# EAGLE design Mega_Shield-v13 (EAGLE 6.5.0)
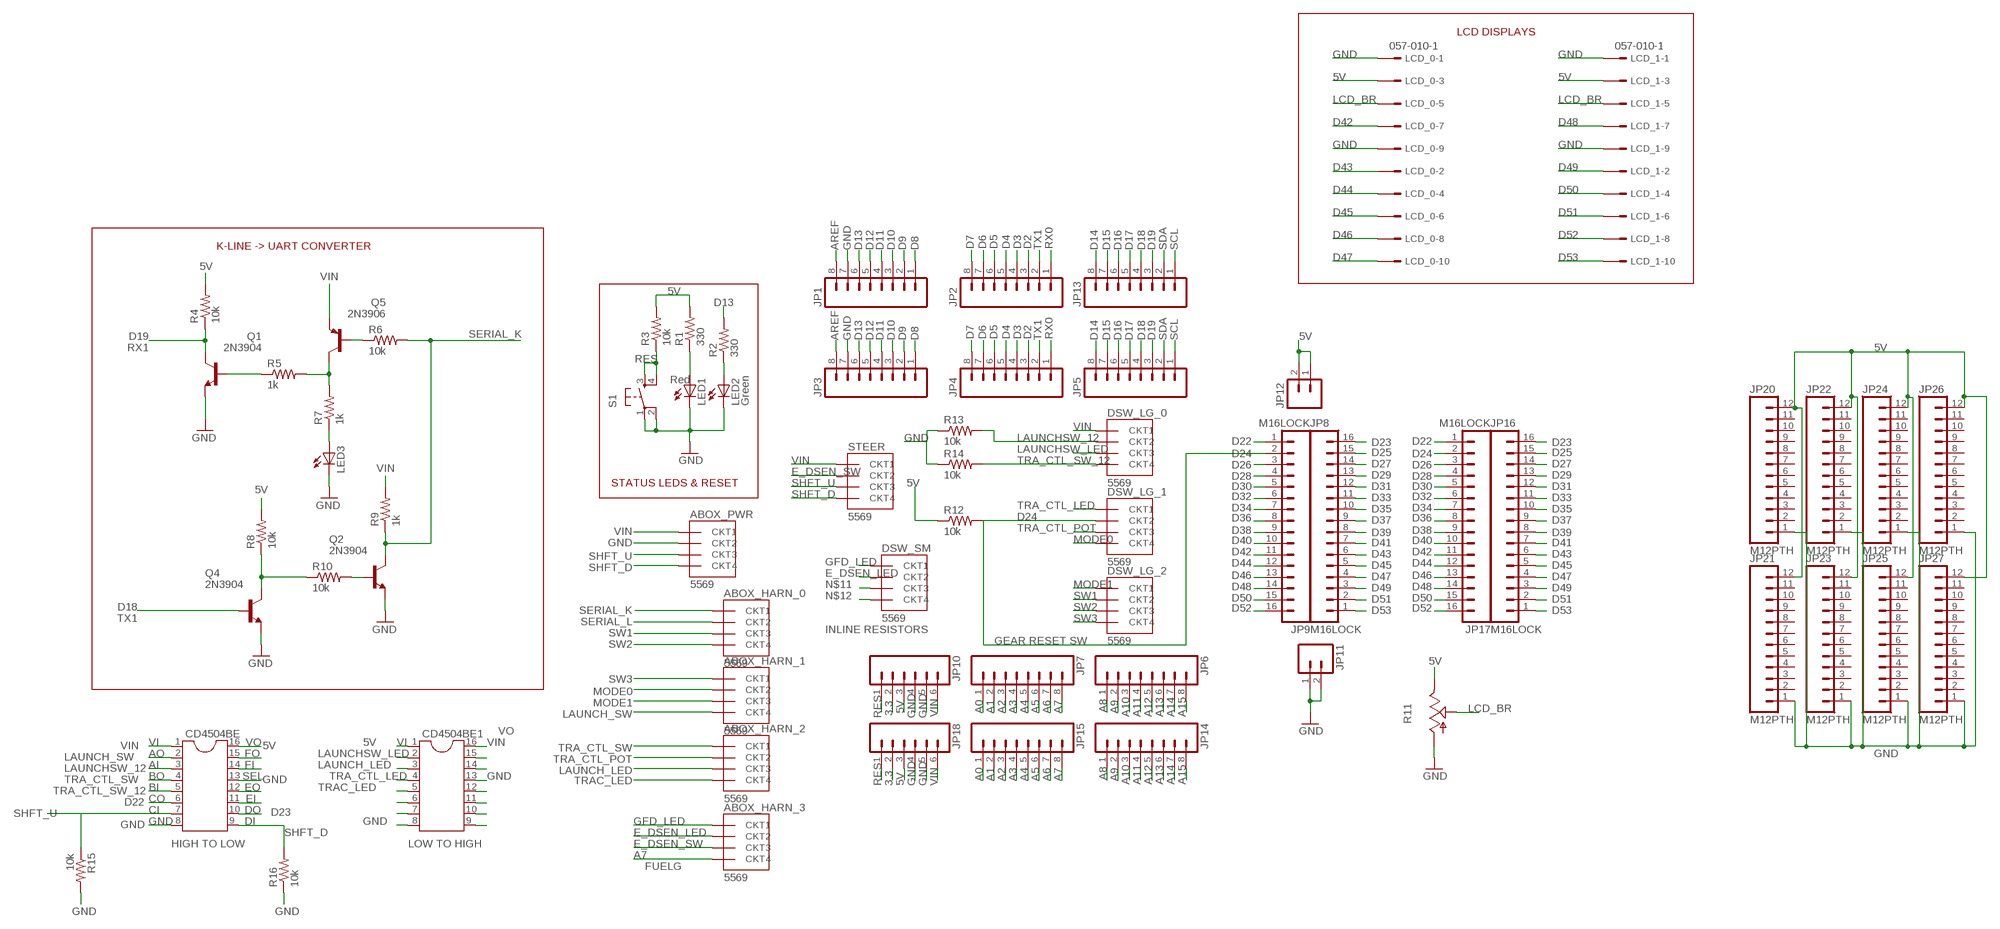
[diagram p0: schematic, sheet 1]

## Parts
ABOX_HARN_0  5569  [5569]
ABOX_HARN_1  5569  [5569]
ABOX_HARN_2  5569  [5569]
ABOX_HARN_3  5569  [5569]
ABOX_PWR  5569  [5569]
CD4504BE  DIL16S  [SOCKET-16]
CD4504BE1  DIL16S  [SOCKET-16]
DSW_LG_0  5569  [5569]
DSW_LG_1  5569  [5569]
DSW_LG_2  5569  [5569]
DSW_SM  5569  [5569]
JP1  M08LOCK  [1X08_LOCK]
JP2  M08LOCK  [1X08_LOCK]
JP3  M08LOCK  [1X08_LOCK]
JP4  M08LOCK  [1X08_LOCK]
JP5  M08LOCK  [1X08_LOCK]
JP6  M08LOCK  [1X08_LOCK]
JP7  M08LOCK  [1X08_LOCK]
JP8  M16LOCK  [1X16_LOCK]
JP9  M16LOCK  [1X16_LOCK]
JP10  M06LOCK  [1X06_LOCK]
JP11  M02LOCK  [1X02_LOCK]
JP12  M02LOCK  [1X02_LOCK]
JP13  M08LOCK  [1X08_LOCK]
JP14  M08LOCK  [1X08_LOCK]
JP15  M08LOCK  [1X08_LOCK]
JP16  M16LOCK  [1X16_LOCK]
JP17  M16LOCK  [1X16_LOCK]
JP18  M06LOCK  [1X06_LOCK]
JP20  M12PTH  [1X12]
JP21  M12PTH  [1X12]
JP22  M12PTH  [1X12]
JP23  M12PTH  [1X12]
JP24  M12PTH  [1X12]
JP25  M12PTH  [1X12]
JP26  M12PTH  [1X12]
JP27  M12PTH  [1X12]
LCD_0  057-010-1  [057-010-1]
LCD_1  057-010-1  [057-010-1]
LED1  Red  LED5MM  [LED5MM]
LED2  Green  LED5MM  [LED5MM]
LED3  LED5MM  [LED5MM]
Q1  2N3904  [TO92]
Q2  2N3904  [TO92]
Q4  2N3904  [TO92]
Q5  2N3906  [TO92]
R1  330  RESISTORPTH1  [AXIAL-0.3]
R2  330  RESISTORPTH1  [AXIAL-0.3]
R3  10k  RESISTORPTH1  [AXIAL-0.3]
R4  10k  RESISTOREZ  [AXIAL-0.3EZ]
R5  1k  RESISTOREZ  [AXIAL-0.3EZ]
R6  10k  RESISTOREZ  [AXIAL-0.3EZ]
R7  1k  RESISTOREZ  [AXIAL-0.3EZ]
R8  10k  RESISTOREZ  [AXIAL-0.3EZ]
R9  1k  RESISTOREZ  [AXIAL-0.3EZ]
R10  10k  RESISTOREZ  [AXIAL-0.3EZ]
R11  TRIM_US-CT6  [CT6]
R12  10k  RESISTOREZ  [AXIAL-0.3EZ]
R13  10k  RESISTOREZ  [AXIAL-0.3EZ]
R14  10k  RESISTOREZ  [AXIAL-0.3EZ]
R15  10k  RESISTOREZ  [AXIAL-0.3EZ]
R16  10k  RESISTOREZ  [AXIAL-0.3EZ]
S1  TAC_SWITCHPTH  [TACTILE-PTH]
STEER  5569  [5569]

## Nets
3.3: JP10.2 JP18.2
5V: CD4504BE1.1 CD4504BE.16 JP10.3 JP12.1 JP12.2 JP18.3 JP20.12 JP21.12 JP22.12 JP23.12 JP24.12 JP25.12 JP26.12 JP27.12 LCD_0.3 LCD_1.3 R1.P$2 R3.P$2 R4.P$2 R8.P$2 R11.E R12.P$1
A0: JP7.1 JP15.1
A1: JP7.2 JP15.2
A2: JP7.3 JP15.3
A3: JP7.4 JP15.4
A4: JP7.5 JP15.5
A5: JP7.6 JP15.6
A6: JP7.7 JP15.7
A7: ABOX_HARN_3.CKT4 JP7.8 JP15.8
A8: JP6.1 JP14.1
A9: JP6.2 JP14.2
A10: JP6.3 JP14.3
A11: JP6.4 JP14.4
A12: JP6.5 JP14.5
A13: JP6.6 JP14.6
A14: JP6.7 JP14.7
A15: JP6.8 JP14.8
AREF: JP1.8 JP3.8
D2: JP2.3 JP4.3
D3: JP2.4 JP4.4
D4: JP2.5 JP4.5
D5: JP2.6 JP4.6
D6: JP2.7 JP4.7
D7: JP2.8 JP4.8
D8: JP1.1 JP3.1
D9: JP1.2 JP3.2
D10: JP1.3 JP3.3
D11: JP1.4 JP3.4
D12: JP1.5 JP3.5
D13: JP1.6 JP3.6 R2.P$2
D14: JP5.8 JP13.8
D15: JP5.7 JP13.7
D16: JP5.6 JP13.6
D17: JP5.5 JP13.5
D18: JP5.4 JP13.4 Q4.2(B)
D19: JP5.3 JP13.3 Q1.1(C) R4.P$1
D22: CD4504BE.6 JP9.1 JP17.1
D23: CD4504BE.10 JP8.16 JP16.16
D24: DSW_LG_1.CKT2 JP9.2 JP17.2 R12.P$2
D25: JP8.15 JP16.15
D26: JP9.3 JP17.3
D27: JP8.14 JP16.14
D28: JP9.4 JP17.4
D29: JP8.13 JP16.13
D30: JP9.5 JP17.5
D31: JP8.12 JP16.12
D32: JP9.6 JP17.6
D33: JP8.11 JP16.11
D34: JP9.7 JP17.7
D35: JP8.10 JP16.10
D36: JP9.8 JP17.8
D37: JP8.9 JP16.9
D38: JP9.9 JP17.9
D39: JP8.8 JP16.8
D40: JP9.10 JP17.10
D41: JP8.7 JP16.7
D42: JP9.11 JP17.11 LCD_0.7
D43: JP8.6 JP16.6 LCD_0.2
D44: JP9.12 JP17.12 LCD_0.4
D45: JP8.5 JP16.5 LCD_0.6
D46: JP9.13 JP17.13 LCD_0.8
D47: JP8.4 JP16.4 LCD_0.10
D48: JP9.14 JP17.14 LCD_1.7
D49: JP8.3 JP16.3 LCD_1.2
D50: JP9.15 JP17.15 LCD_1.4
D51: JP8.2 JP16.2 LCD_1.6
D52: JP9.16 JP17.16 LCD_1.8
D53: JP8.1 JP16.1 LCD_1.10
E_DSEN_LED: ABOX_HARN_3.CKT2 DSW_SM.CKT2
E_DSEN_SW: ABOX_HARN_3.CKT3 STEER.CKT2
GFD_LED: ABOX_HARN_3.CKT1 DSW_SM.CKT1
GND: ABOX_PWR.CKT2 CD4504BE1.8 CD4504BE1.13 CD4504BE.8 CD4504BE.13 JP1.7 JP3.7 JP10.4 JP10.5 JP11.1 JP11.2 JP18.4 JP18.5 JP20.1 JP21.1 JP22.1 JP23.1 JP24.1 JP25.1 JP26.1 JP27.1 LCD_0.1 LCD_0.9 LCD_1.1 LCD_1.9 LED1.K(C) LED2.K(C) LED3.K(C) Q1.3(E) Q2.3(E) Q4.3(E) R11.A R13.P$1 R14.P$1 R15.P$2 R16.P$1 S1.1 S1.2
LAUNCH_LED: ABOX_HARN_2.CKT3 CD4504BE1.3
LAUNCH_SW: ABOX_HARN_1.CKT4 CD4504BE.2
LAUNCHSW_12: CD4504BE.3 DSW_LG_0.CKT2 R13.P$2
LAUNCHSW_LED: CD4504BE1.2 DSW_LG_0.CKT3
LCD_BR: LCD_0.5 LCD_1.5 R11.S
MODE0: ABOX_HARN_1.CKT2 DSW_LG_1.CKT4
MODE1: ABOX_HARN_1.CKT3 DSW_LG_2.CKT1
N$2: CD4504BE.11
N$4: Q1.2(B) R5.P$1
N$5: Q5.1(C) R5.P$2 R7.P$2
N$6: Q5.2(B) R6.P$1
N$7: LED3.A R7.P$1
N$8: Q2.2(B) R10.P$2
N$10: Q4.1(C) R8.P$1 R10.P$1
N$11: DSW_SM.CKT3
N$12: DSW_SM.CKT4
N$19: CD4504BE.15
N$20: CD4504BE.14
N$22: CD4504BE.12
N$27: CD4504BE1.6
N$28: CD4504BE1.7
N$32: CD4504BE1.15
N$33: CD4504BE1.14
N$35: CD4504BE1.12
N$36: CD4504BE1.11
N$37: CD4504BE1.10
N$38: CD4504BE1.9
N$126: LED1.A R1.P$1
N$127: LED2.A R2.P$1
RES: JP10.1 JP18.1 R3.P$1 S1.3 S1.4
RX0: JP2.1 JP4.1
SCL: JP5.1 JP13.1
SDA: JP5.2 JP13.2
SERIAL_K: ABOX_HARN_0.CKT1 Q2.1(C) R6.P$2 R9.P$1
SERIAL_L: ABOX_HARN_0.CKT2
SHFT_D: ABOX_PWR.CKT4 CD4504BE.9 R16.P$2 STEER.CKT4
SHFT_U: ABOX_PWR.CKT3 CD4504BE.7 R15.P$1 STEER.CKT3
SW1: ABOX_HARN_0.CKT3 DSW_LG_2.CKT2
SW2: ABOX_HARN_0.CKT4 DSW_LG_2.CKT3
SW3: ABOX_HARN_1.CKT1 DSW_LG_2.CKT4
TRA_CTL_LED: CD4504BE1.4 DSW_LG_1.CKT1
TRA_CTL_POT: ABOX_HARN_2.CKT2 DSW_LG_1.CKT3
TRA_CTL_SW: ABOX_HARN_2.CKT1 CD4504BE.4
TRA_CTL_SW_12: CD4504BE.5 DSW_LG_0.CKT4 R14.P$2
TRAC_LED: ABOX_HARN_2.CKT4 CD4504BE1.5
TX1: JP2.2 JP4.2
VIN: ABOX_PWR.CKT1 CD4504BE1.16 CD4504BE.1 DSW_LG_0.CKT1 JP10.6 JP18.6 Q5.3(E) R9.P$2 STEER.CKT1
Unconnected: JP20.2 JP20.3 JP20.4 JP20.5 JP20.6 JP20.7 JP20.8 JP20.9 JP20.10 JP20.11 JP21.2 JP21.3 JP21.4 JP21.5 JP21.6 JP21.7 JP21.8 JP21.9 JP21.10 JP21.11 JP22.2 JP22.3 JP22.4 JP22.5 JP22.6 JP22.7 JP22.8 JP22.9 JP22.10 JP22.11 JP23.2 JP23.3 JP23.4 JP23.5 JP23.6 JP23.7 JP23.8 JP23.9 JP23.10 JP23.11 JP24.2 JP24.3 JP24.4 JP24.5 JP24.6 JP24.7 JP24.8 JP24.9 JP24.10 JP24.11 JP25.2 JP25.3 JP25.4 JP25.5 JP25.6 JP25.7 JP25.8 JP25.9 JP25.10 JP25.11 JP26.2 JP26.3 JP26.4 JP26.5 JP26.6 JP26.7 JP26.8 JP26.9 JP26.10 JP26.11 JP27.2 JP27.3 JP27.4 JP27.5 JP27.6 JP27.7 JP27.8 JP27.9 JP27.10 JP27.11

## Notes on the sheet
- LCD DISPLAYS
- K-LINE -> UART CONVERTER
- RX1
- STATUS LEDS & RESET
- TX1
- INLINE RESISTORS
- GEAR RESET SW
- VO
- VI | VO | VI
- AO | FO
- AI | FI
- BO | SEL
- BI | EO
- CO | EI
- CI | DO
- GND | DI
- HIGH TO LOW | LOW TO HIGH
- FUELG

## Library data of the parts
ABOX_HARN_0 ABOX_HARN_1-ABOX_HARN_3 ABOX_PWR DSW_LG_0 DSW_LG_1 DSW_LG_2 DSW_SM STEER = MHR14:5569
CD4504BE CD4504BE1 = ic-package:DIL16: Dual In Line / Socket
JP1-JP7 JP13-JP15 = SparkFun:M08: Header 8 Standard 8-pin 0.1" header. Use with straight break away headers (SKU : PRT-00116), right angle break away headers (PRT-00553), swiss pins (PRT-00743), machine pins (PRT-00117), and female headers (PRT-00115).
JP8 JP9 JP16 JP17 = SparkFun:M16
JP10 JP18 = SparkFun:M06: Header 6 Standard 6-pin 0.1" header. Use with straight break away headers (SKU : PRT-00116), right angle break away headers (PRT-00553), swiss pins (PRT-00743), machine pins (PRT-00117), and female headers (PRT-00115). Molex polarized connector foot print use with SKU : PRT-08094 with associated crimp pins and housings. NOTES ON THE VARIANTS LOCK and LOCK_LONGPADS... This footprint was designed to help hold the alignment of a through-hole component (i.e. 6-pin header) while soldering it into place. You may notice that each hole has been shifted either up or down by 0.005 of an inch from it's more standard position (which is a perfectly straight line). This slight alteration caused the pins (the squares in the middle) to touch the edges of the holes. Because they are alternating, it causes a "brace" to hold the component in place. 0.005 has proven to be the perfect amount of "off-center" position when using our standard breakaway headers. Although looks a little odd when you look at the bare footprint, once you have a header in there, the alteration is very hard to notice. Also, if you push a header all the way into place, it is covered up entirely on the bottom side. This idea of altering the position of holes to aid alignment will be further integrated into the Sparkfun Library for other footprints. It can help hold any component with 3 or more connection pins.
JP11 JP12 = SparkFun:M02: Header 2 Standard 2-pin 0.1" header. Use with straight break away headers (SKU : PRT-00116), right angle break away headers (PRT-00553), swiss pins (PRT-00743), machine pins (PRT-00117), and female headers (PRT-00115). Molex polarized connector foot print use with SKU : PRT-08233 with associated crimp pins and housings.
JP20-JP27 = SparkFun-Connectors:M12: Header 12 Standard 12-pin 0.1" header. Use with straight break away headers (SKU : PRT-00116), right angle break away headers (PRT-00553), swiss pins (PRT-00743), machine pins (PRT-00117), and female headers (PRT-00115).
LCD_0 LCD_1 = con-panduit:057-010-: CONNECTOR 10-pin series 057 contact pc board low profile headers; OC_FARNELL: unknown; OC_NEWARK: unknown
LED1 LED2 = SparkFun:LED: LEDs Standard schematic elements and footprints for 5mm, 3mm, 1206, and 0603 sized LEDs. 5mm - Spark Fun Electronics SKU : COM-00529 (and others)
LED3 = led:LED: LED OSRAM: - CHIPLED LG R971, LG N971, LY N971, LG Q971, LY Q971, LO R971, LY R971 LH N974, LH R974 LS Q976, LO Q976, LY Q976 LO Q996 - Hyper CHIPLED LW Q18S LB Q993, LB Q99A, LB R99A - SideLED LS A670, LO A670, LY A670, LG A670, LP A670 LB A673, LV A673, LT A673, LW A673 LH A674 LY A675 LS A676, LA A676, LO A676, LY A676, LW A676 LS A679, LY A679, LG A679 - Hyper Micro SIDELED® LS Y876, LA Y876, LO Y876, LY Y876 LT Y87S - SmartLED LW L88C, LW L88S LB L89C, LB L89S, LG L890 LS L89K, LO L89K, LY L89K LS L896, LA L896, LO L896, LY L896 - TOPLED LS T670, LO T670, LY T670, LG T670, LP T670 LSG T670, LSP T670, LSY T670, LOP T670, LYG T670 LG T671, LOG T671, LSG T671 LB T673, LV T673, LT T673, LW T673 LH T674 LS T676, LA T676, LO T676, LY T676, LB T676, LH T676, LSB T676, LW T676 LB T67C, LV T67C, LT T67C, LS T67K, LO T67K, LY T67K, LW E67C LS E67B, LA E67B, LO E67B, LY E67B, LB E67C, LV E67C, LT E67C LW T67C LS T679, LY T679, LG T679 LS T770, LO T770, LY T770, LG T770, LP T770 LB T773, LV T773, LT T773, LW T773 LH T774 LS E675, LA E675, LY E675, LS T675 LS T776, LA T776, LO T776, LY T776, LB T776 LHGB T686 LT T68C, LB T68C - Hyper Mini TOPLED® LB M676 - Mini TOPLED Santana® LG M470 LS M47K, LO M47K, LY M47K Source: http://www.osram.convergy.de LUXEON: - LUMILED® LXK2-PW12-R00, LXK2-PW12-S00, LXK2-PW14-U00, LXK2-PW14-V00 LXK2-PM12-R00, LXK2-PM12-S00, LXK2-PM14-U00 LXK2-PE12-Q00, LXK2-PE12-R00, LXK2-PE12-S00, LXK2-PE14-T00, LXK2-PE14-U00 LXK2-PB12-K00, LXK2-PB12-L00, LXK2-PB12-M00, LXK2-PB14-N00, LXK2-PB14-P00, LXK2-PB14-Q00 LXK2-PR12-L00, LXK2-PR12-M00, LXK2-PR14-Q00, LXK2-PR14-R00 LXK2-PD12-Q00, LXK2-PD12-R00, LXK2-PD12-S00 LXK2-PH12-R00, LXK2-PH12-S00 LXK2-PL12-P00, LXK2-PL12-Q00, LXK2-PL12-R00 Source: www.luxeon.com KINGBRIGHT: KA-3528ASYC Source: www.kingbright.com
Q1 Q2 Q4 = transistor-npn:2N3904: NPN Transistor
Q5 = transistor-pnp:2N3906: PNP Transistor
R1-R3 = SparkFun:RESISTOR: Resistor
R4-R10 R12-R16 = SparkFun-Passives:RESISTOR: Resistor
R11 = pot:TRIM_US-: POTENTIOMETER
S1 = SparkFun:TAC_SWITCH: Momentary Switch Button commonly used for reset or general input. Spark Fun Electronics SKU : COM-00097

## Board
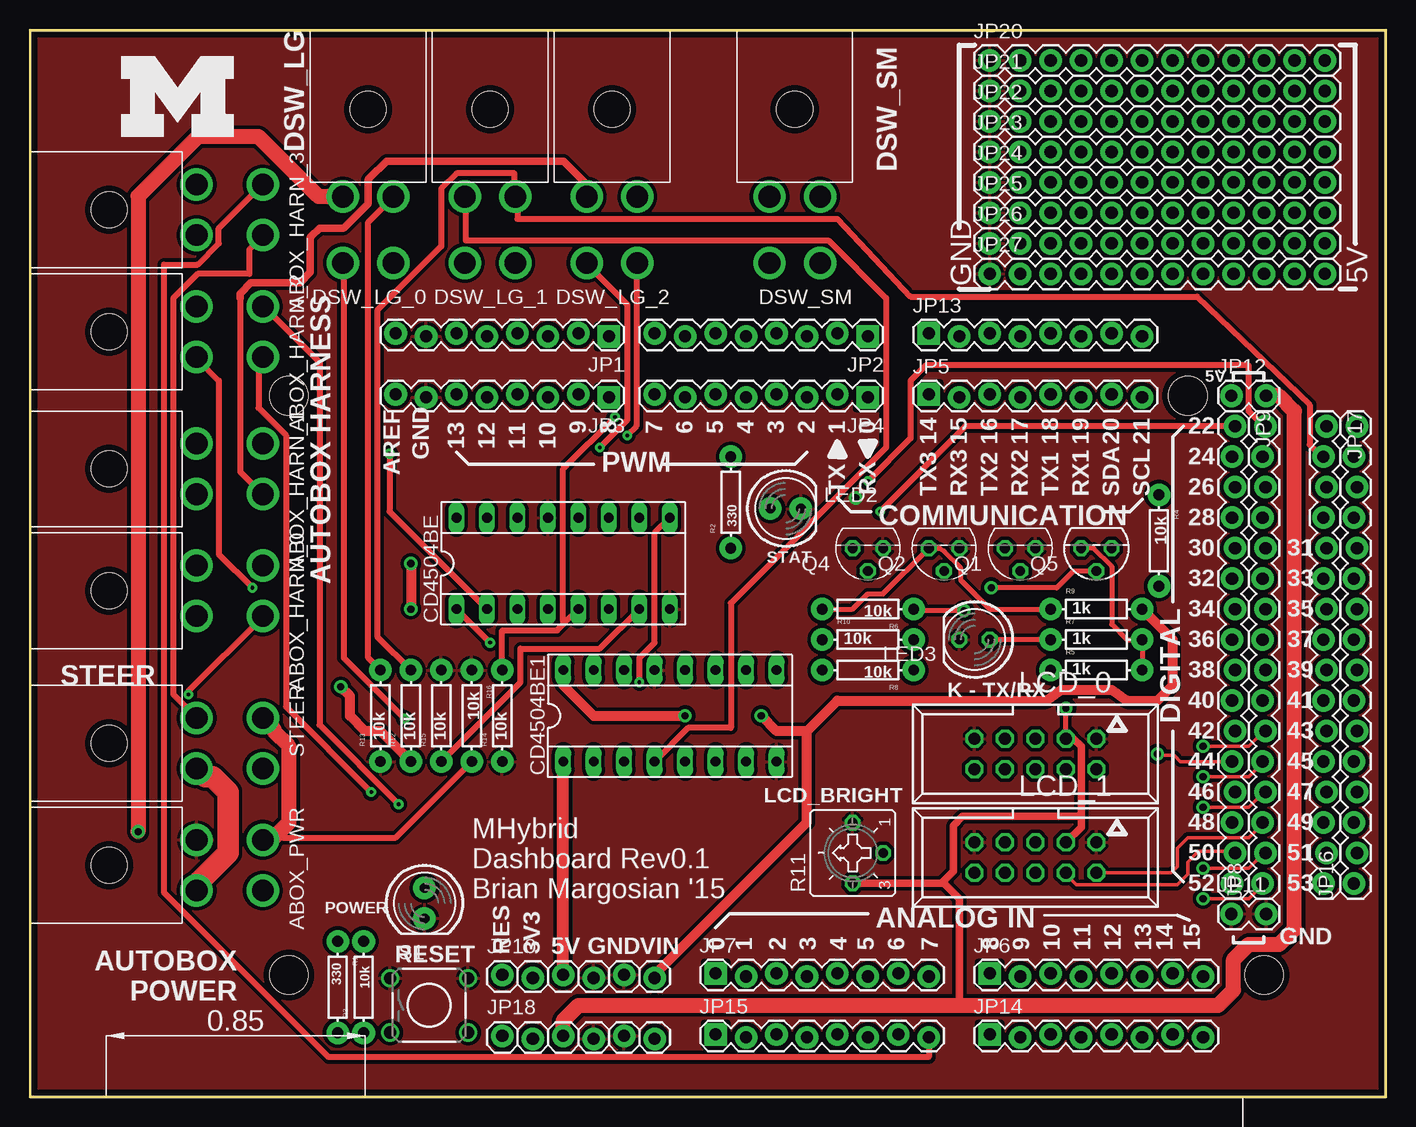
[diagram p1: board, top side]
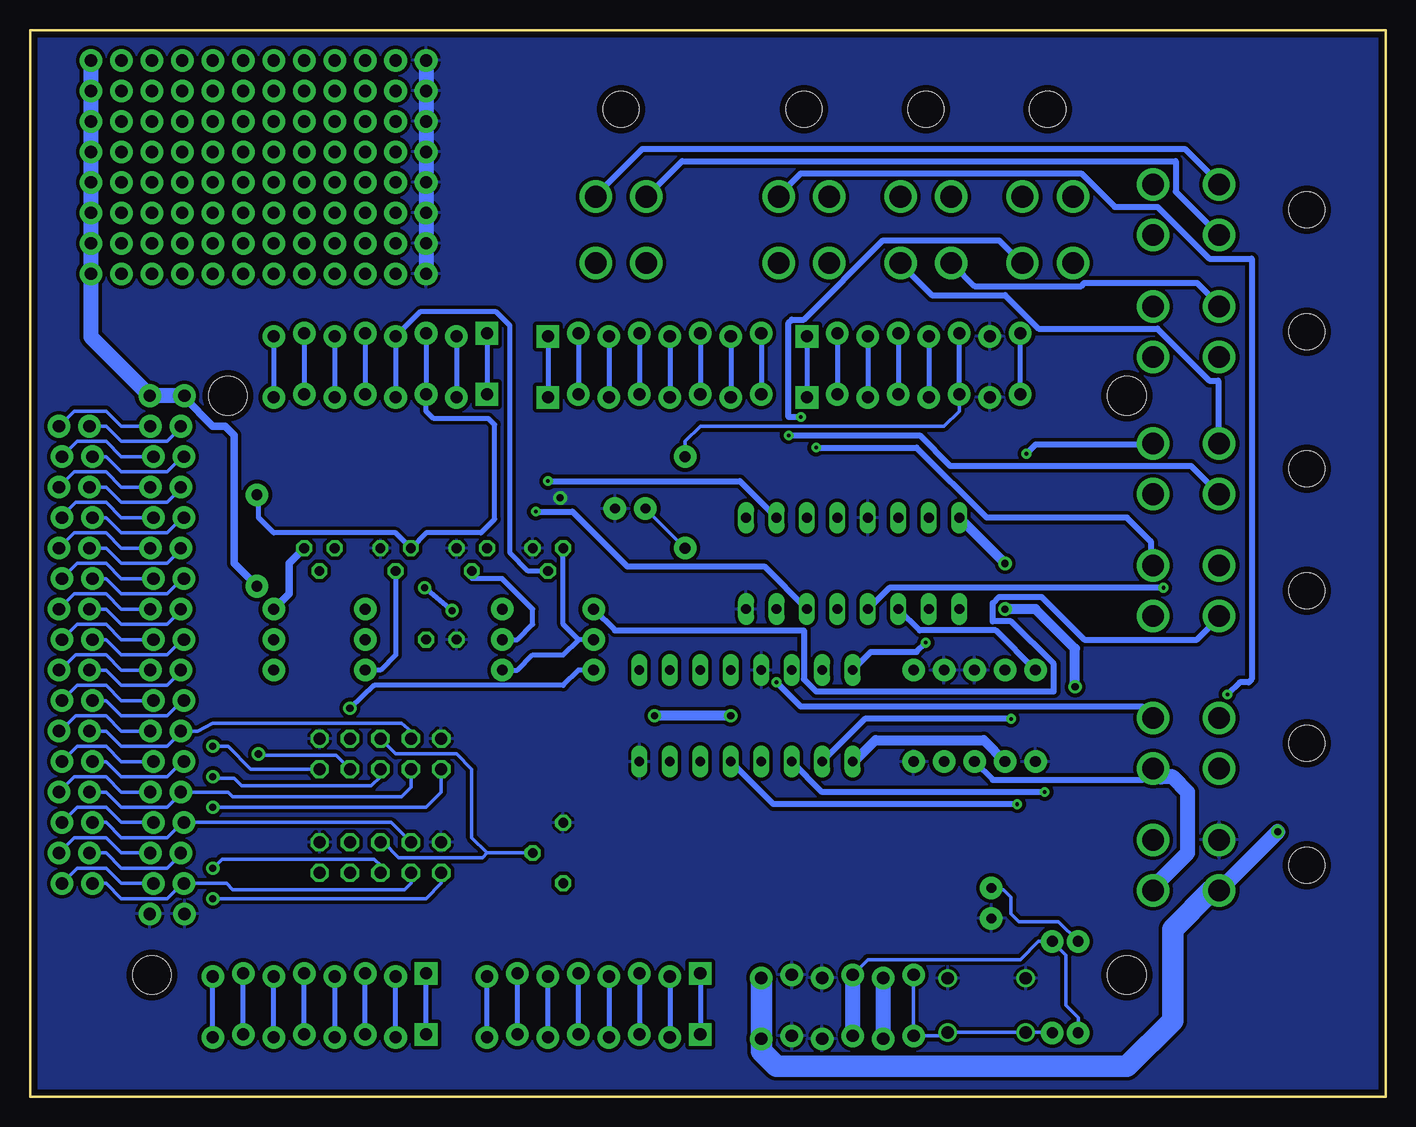
[diagram p2: board, bottom side, seen from below]

Size 113.03 x 88.9 mm. Coordinates in mm from the lower left corner, seen from the top.
Outline: 0,0 113.03,0 113.03,88.9 0,88.9 0,0
Copper layers (1+16): Top 0.0178mm / dielectric 12mil / Bottom 0.0178mm
Design rules "AVC-2Lyr *": minimum track width 20mil, minimum drill 12mil, track to track 10mil, track to pad 6mil, pad to pad 6mil, via to via 6mil, smd to smd 6mil, copper to edge 20mil, drill to drill 16mil, minimum pad ring 10mil, minimum via ring 10mil, stop-mask expansion 3mil, vias tented up to drill 0mil, thermal gap 10mil
Holes 3.2 mm at 21.59,58.42 21.59,10.16 96.52,58.42 102.87,10.16

### Footprints (pad centres in the part's own frame; a part is rotated, then mirrored left to right if it is on the bottom)
5569 = drill 1.803: CKT1 6.934,13.894; CKT2 2.718,13.894; CKT3 6.934,19.406; CKT4 2.718,19.406 | hole 2.997: 4.826,6.604
SOCKET-16 = drill 0.813 long: 1 -8.89,-3.81; 2 -6.35,-3.81; 3 -3.81,-3.81; 4 -1.27,-3.81; 5 1.27,-3.81; 6 3.81,-3.81; 7 6.35,-3.81; 8 8.89,-3.81; 9 8.89,3.81; 10 6.35,3.81; 11 3.81,3.81; 12 1.27,3.81; 13 -1.27,3.81; 14 -3.81,3.81; 15 -6.35,3.81; 16 -8.89,3.81
1X08_LOCK = drill 1.016 pad 1.88 square: 1 0,0.127 | drill 1.016 pad 1.88: 2 2.54,-0.127; 3 5.08,0.127; 4 7.62,-0.127; 5 10.16,0.127; 6 12.7,-0.127; 7 15.24,0.127; 8 17.78,-0.127
1X16_LOCK = drill 1.016 pad 1.88: 1 0,0.127; 2 2.54,-0.127; 3 5.08,0.127; 4 7.62,-0.127; 5 10.16,0.127; 6 12.7,-0.127; 7 15.24,0.127; 8 17.78,-0.127; 9 20.32,0.127; 10 22.86,-0.127; 11 25.4,0.127; 12 27.94,-0.127; 13 30.48,0.127; 14 33.02,-0.127; 15 35.56,0.127; 16 38.1,-0.127
1X06_LOCK = drill 1.016 pad 1.88: 1 0,0; 2 2.54,-0.254; 3 5.08,0; 4 7.62,-0.254; 5 10.16,0; 6 12.7,-0.254
1X02_LOCK = drill 1.016 pad 1.88: 1 -0.178,0; 2 2.718,0
1X12 = drill 1.016 pad 1.88: 1 0,0; 2 2.54,0; 3 5.08,0; 4 7.62,0; 5 10.16,0; 6 12.7,0; 7 15.24,0; 8 17.78,0; 9 20.32,0; 10 22.86,0; 11 25.4,0; 12 27.94,0
057-010-1 = drill 1 octagon: 1 -5.08,-1.27; 2 -5.08,1.27; 3 -2.54,-1.27; 4 -2.54,1.27; 5 0,-1.27; 6 0,1.27; 7 2.54,-1.27; 8 2.54,1.27; 9 5.08,-1.27; 10 5.08,1.27
LED5MM = drill 0.813 pad 1.88: A -1.27,0; K 1.27,0
LED5MM' = drill 0.813 octagon: A -1.27,0; K 1.27,0
TO92 = drill 0.813 octagon: 1 1.27,0; 2 0,1.905; 3 -1.27,0
AXIAL-0.3 = drill 0.9 pad 1.88: P$1 -3.81,0; P$2 3.81,0
AXIAL-0.3EZ = drill 0.9 pad 1.88: P$1 -3.81,0; P$2 3.81,0
CT6 = drill 0.813 octagon: A 2.515,0; E -2.515,0; S 0,-2.54
TACTILE-PTH = drill 1.016: 1 -3.251,2.261; 2 3.251,2.261; 3 -3.251,-2.261; 4 3.251,-2.261

### Placement (x,y rotation side)
ABOX_HARN_0  0,46.99 270 top
ABOX_HARN_1  0,57.15 270 top
ABOX_HARN_2  0,68.58 270 top
ABOX_HARN_3  0,78.74 270 top
ABOX_PWR  0,24.13 270 top
CD4504BE  44.45,44.45 0 top
CD4504BE1  53.34,31.75 0 top
DSW_LG_0  33.02,88.9 180 top
DSW_LG_1  43.18,88.9 180 top
DSW_LG_2  53.34,88.9 180 top
DSW_SM  68.58,88.9 180 top
JP1  48.26,63.5 180 top
JP2  69.85,63.5 180 top
JP3  48.26,58.42 180 top
JP4  69.85,58.42 180 top
JP5  74.93,58.42 0 top
JP6  80.01,10.16 0 top
JP7  57.15,10.16 0 top
JP8  102.87,17.78 90 top
JP9  100.33,55.88 270 top
JP10  39.37,10.16 0 top
JP11  100.33,15.24 0 top
JP12  100.33,58.42 0 top
JP13  74.93,63.5 0 top
JP14  80.01,5.08 0 top
JP15  57.15,5.08 0 top
JP16  110.49,17.78 90 top
JP17  107.95,55.88 270 top
JP18  39.37,5.08 0 top
JP20  80.01,86.36 0 top
JP21  80.01,83.82 0 top
JP22  80.01,81.28 0 top
JP23  80.01,78.74 0 top
JP24  80.01,76.2 0 top
JP25  80.01,73.66 0 top
JP26  80.01,71.12 0 top
JP27  80.01,68.58 0 top
LCD_0  83.82,28.57 180 top
LCD_1  83.82,19.94 180 top
LED1  32.89,16.13 270 top
LED2  62.99,49.02 0 top
LED3  [LED5MM']  78.74,38.1 180 top
Q1  82.55,45.72 180 top
Q2  76.2,45.72 180 top
Q4  69.85,45.72 180 top
Q5  88.9,45.72 180 top
R1  25.65,9.14 270 top
R2  58.42,49.53 90 top
R3  27.81,9.14 90 top
R4  94.11,46.35 270 top
R5  88.9,35.56 0 top
R6  69.85,40.64 180 top
R7  88.9,38.1 0 top
R8  69.85,35.56 180 top
R9  88.9,40.64 0 top
R10  69.85,38.1 0 top
R11  68.58,20.32 90 top
R12  31.75,31.75 90 top
R13  29.21,31.75 90 top
R14  39.37,31.75 90 top
R15  34.29,31.75 90 top
R16  36.83,31.75 270 top
S1  33.27,7.62 0 top
STEER  0,34.29 270 top
U$1  [BLOCKM]  7.62,80.01 0 top

### Tracks (layer width: path | path; a pad name or v marks a point on that pad's centre or on a via)
3.3
  Top 0.203: JP10.2 41.91,10.16
  Bottom 1.27: JP10.2 JP18.2
5V  (via drill 0.6)
  Top 0.406: LCD_0.3 v86.36,32.38
  Top 0.61: LCD_0.3 87,29.84 87.63,29.21 87.63,23.62 | 87.63,23.62 87.63,22.48 LCD_1.3 | 87.63,23.62 87.38,23.37 77.72,23.37 76.96,22.61 76.96,18.8 75.97,17.8 R11.E 76.17,17.8 77.47,16.51 77.47,7.62
  Top 0.813: R12.P$1 29.21,30.48 27.94,30.48 26.67,31.75 26.67,33.4 v25.91,34.16 | v31.75,44.45 v31.75,40.64
  Top 1.016: JP10.3 CD4504BE1.1
  Top 1.27: JP18.3 44.45,6.35 45.72,7.62 77.47,7.62 99.06,7.62 100.33,8.89 100.33,11.43 101.6,12.7 104.14,12.7 105.41,13.97 105.41,57.15 104.14,58.42 JP12.2
  Bottom 0.305: JP10.3 43.18,11.43 30.48,11.43 28.96,12.95 R3.P$2 26.67,11.81 26.67,7.62 25.65,6.6 R1.P$2
  Bottom 0.406: 100.71,58.8 100.33,58.42 JP12.1 | R8.P$2 67.31,35.56 68.58,34.29 84.33,34.29 v86.36,32.38
  Bottom 0.61: JP12.1 100.15,58.24 97.79,55.88 96.77,55.88 96.01,55.12 96.01,44.45 R4.P$2
  Bottom 0.813: CD4504BE1.1 44.32,27.94 42.55,29.72 33.53,29.72 R12.P$1 | CD4504BE.16 v31.75,44.45 | v25.91,34.16 25.91,37.34 29.21,40.64 v31.75,40.64
  Bottom 1.27: JP10.3 JP18.3 | 100.33,58.42 JP12.2 107.95,63.32 JP27.12 JP26.12 JP25.12 JP24.12 JP23.12 JP22.12 JP21.12 JP20.12
A0
  Bottom 0.406: 57.15,10.16 JP15.1
  Bottom 0.508: 57.15,10.16 JP7.1
A1
  Top 0.203: JP7.2 59.69,10.16
  Bottom 0.406: JP7.2 JP15.2
A2
  Bottom 0.406: 62.23,10.16 JP15.3
  Bottom 0.508: 62.23,10.16 JP7.3
A3
  Top 0.203: JP7.4 64.77,10.16
  Bottom 0.406: JP7.4 JP15.4
A4
  Top 0.203: JP7.5 67.31,10.16
  Bottom 0.406: JP15.5 JP7.5
A5
  Top 0.203: JP7.6 69.85,10.16
  Bottom 0.406: JP15.6 JP7.6
A6
  Top 0.203: JP7.7 72.39,10.16
  Bottom 0.406: JP15.7 JP7.7
A7
  Top 0.203: JP7.8 74.93,10.16
  Top 0.508: JP15.8 74.93,3.3 24.89,3.3 11.18,17.02 11.18,69.34 13.97,69.34 15.75,71.12 15.75,72.39 19.3,75.95 ABOX_HARN_3.CKT4
  Bottom 0.406: JP15.8 JP7.8
A8
  Top 0.203: JP6.1 80.01,10.16
  Bottom 0.406: JP14.1 JP6.1
A9
  Top 0.203: JP6.2 82.55,10.16
  Bottom 0.406: JP14.2 JP6.2
A10
  Top 0.203: JP6.3 85.09,10.16
  Bottom 0.406: JP14.3 JP6.3
A11
  Top 0.203: JP6.4 87.63,10.16
  Bottom 0.406: JP6.4 JP14.4
A12
  Top 0.203: JP6.5 90.17,10.16
  Bottom 0.406: JP14.5 JP6.5
A13
  Top 0.203: JP6.6 92.71,10.16
  Bottom 0.406: JP14.6 JP6.6
A14
  Top 0.203: JP6.7 95.25,10.16
  Bottom 0.406: JP14.7 JP6.7
A15
  Top 0.203: JP6.8 97.79,10.16
  Bottom 0.406: JP14.8 JP6.8
AREF
  Top 0.203: JP3.8 30.48,58.42
  Bottom 0.406: JP3.8 JP1.8
D2
  Top 0.203: JP4.3 64.77,58.42
  Bottom 0.406: JP2.3 JP4.3
D3
  Top 0.203: JP4.4 62.23,58.42
  Bottom 0.406: JP2.4 JP4.4 62.23,58.42
D4
  Top 0.203: JP4.5 59.69,58.42
  Bottom 0.406: JP2.5 JP4.5
D5
  Top 0.203: JP4.6 57.15,58.42
  Bottom 0.406: JP2.6 JP4.6
D6
  Top 0.203: JP4.7 54.61,58.42
  Bottom 0.406: JP2.7 JP4.7
D7
  Top 0.203: JP4.8 52.07,58.42
  Bottom 0.406: JP2.8 JP4.8
D8
  Top 0.203: JP3.1 48.26,58.42
  Bottom 0.406: JP1.1 JP3.1
D9
  Top 0.203: JP3.2 45.72,58.42
  Bottom 0.406: JP1.2 JP3.2
D10
  Top 0.203: JP3.3 43.18,58.42
  Bottom 0.406: JP1.3 JP3.3
D11
  Top 0.203: JP3.4 40.64,58.42
  Bottom 0.406: JP1.4 JP3.4
D12
  Top 0.203: JP3.5 38.1,58.42
  Bottom 0.406: JP1.5 JP3.5
D13
  Bottom 0.305: R2.P$2 58.42,54.61 57.15,55.88 36.83,55.88 35.56,57.15 JP3.6
  Bottom 0.406: JP3.6 JP1.6
D14
  Top 0.203: JP5.8 92.71,58.42
  Bottom 0.406: JP13.8 JP5.8
D15
  Top 0.203: JP5.7 90.17,58.42
  Bottom 0.406: JP13.7 JP5.7
D16
  Top 0.203: JP5.6 87.63,58.42
  Bottom 0.406: JP13.6 JP5.6
D17
  Top 0.203: JP5.5 85.09,58.42
  Bottom 0.406: JP13.5 JP5.5
D18
  Top 0.203: JP5.4 82.55,58.42
  Bottom 0.406: JP5.4 JP13.4 80.52,65.41 74.17,65.41 73.03,64.26 73.03,45.34 71.5,43.81 Q4.2
D19
  Bottom 0.406: JP13.3 JP5.3 80.01,57.15 79.38,56.52 74.8,56.52 74.3,56.01 74.3,48.13 75.44,46.99 80.01,46.99 Q1.1 82.55,46.99 92.71,46.99 93.98,48.26 93.98,50.04 R4.P$1
D22  (via drill 0.3)
  Top 0.508: v70.87,48.77 77.98,55.88 JP9.1
  Bottom 0.305: JP9.1 100.46,55.75 101.6,54.61 105.41,54.61 106.68,55.88 JP17.1
  Bottom 0.508: CD4504BE.6 51.82,44.2 63.25,44.2 67.82,48.77 v70.87,48.77
D23  (via drill 0.3)
  Top 0.508: v69.85,51.31 73.41,54.86 73.41,59.69 74.68,60.96 101.6,60.96 101.6,57.15 102.87,55.88 JP8.16
  Bottom 0.305: JP8.16 105.41,55.88 106.68,57.15 109.35,57.15 JP16.16
  Bottom 0.508: CD4504BE.10 53.85,51.31 v69.85,51.31
D24
  Top 0.508: R12.P$2 28.96,38.35 28.96,65.53 34.29,70.87 34.29,75.69 35.56,76.96 40.39,76.96 40.39,75.18 DSW_LG_1.CKT2 40.64,74.93 40.64,73.15 67.31,73.15 73.41,66.67 97.28,66.67 106.68,57.66 106.68,54.36 107.7,53.34 JP17.2
  Bottom 0.305: 100.33,53.34 101.6,52.07 105.41,52.07 106.68,53.34 JP17.2
  Bottom 0.508: 100.33,53.34 JP9.2
D25
  Bottom 0.305: JP8.15 105.41,53.34 106.68,54.61 109.09,54.61 JP16.15
D26
  Bottom 0.305: JP9.3 100.46,50.67 101.6,49.53 105.41,49.53 106.68,50.8 JP17.3
D27
  Bottom 0.305: JP8.14 105.41,50.8 106.68,52.07 109.35,52.07 JP16.14
D28
  Bottom 0.305: JP9.4 100.33,48.26 101.6,46.99 105.41,46.99 106.68,48.26 JP17.4
D29
  Bottom 0.305: JP16.13 110.36,48.39 109.22,49.53 106.68,49.53 105.41,48.26 JP8.13
D30
  Bottom 0.305: JP9.5 100.46,45.59 101.6,44.45 105.41,44.45 106.68,45.72 JP17.5
D31
  Bottom 0.305: JP8.12 105.41,45.72 106.68,46.99 109.35,46.99 JP16.12
D32
  Bottom 0.305: JP9.6 100.33,43.18 101.6,41.91 105.41,41.91 106.68,43.18 JP17.6
D33
  Bottom 0.305: JP8.11 105.41,43.18 106.68,44.45 109.09,44.45 JP16.11
D34
  Bottom 0.305: JP9.7 100.46,40.51 101.6,39.37 105.41,39.37 106.68,40.64 JP17.7
D35
  Bottom 0.305: JP8.10 105.41,40.64 106.68,41.91 109.35,41.91 JP16.10
D36
  Bottom 0.305: JP9.8 100.33,38.1 101.6,36.83 105.41,36.83 106.68,38.1 JP17.8
D37
  Bottom 0.305: JP8.9 105.41,38.1 106.68,39.37 109.09,39.37 JP16.9
D38
  Bottom 0.305: JP9.9 100.46,35.43 101.6,34.29 105.41,34.29 106.68,35.56 JP17.9
D39
  Bottom 0.305: JP8.8 105.41,35.56 106.68,36.83 109.22,36.83 110.49,35.56 JP16.8
D40
  Bottom 0.305: JP9.10 100.33,33.02 101.6,31.75 105.41,31.75 106.68,33.02 JP17.10
D41
  Bottom 0.305: JP8.7 105.41,33.02 106.68,34.29 109.09,34.29 JP16.7
D42
  Bottom 0.305: JP17.11 106.68,30.48 105.41,29.21 101.6,29.21 100.46,30.35 JP9.11 99.06,30.48 97.79,31.11 82.04,31.11 81.28,30.48 LCD_0.7
D43  (via drill 0.6)
  Top 0.305: JP8.6 102.87,30.48 101.6,29.21 v97.79,29.21
  Bottom 0.305: JP8.6 105.41,30.48 106.68,31.75 109.22,31.75 110.49,30.48 JP16.6 | LCD_0.2 94.61,27.3 96.52,29.21 v97.79,29.21
D44  (via drill 0.6)
  Top 0.305: JP9.12 95.89,27.94 95.38,28.45 94.11,28.45 v93.98,28.57
  Bottom 0.305: JP9.12 100.33,27.94 101.6,26.67 105.41,26.67 106.68,27.94 JP17.12 | LCD_0.4 87.5,28.45 93.98,28.45 v93.98,28.57
D45  (via drill 0.6)
  Top 0.305: JP8.5 102.74,27.81 101.6,26.67 v97.79,26.67
  Bottom 0.305: JP8.5 105.41,27.94 106.68,29.21 109.09,29.21 JP16.5 | LCD_0.6 83.82,26.67 84.58,25.91 95.38,25.91 96.01,26.54 97.66,26.54 v97.79,26.67
D46
  Bottom 0.305: JP17.13 106.68,25.4 105.41,24.13 101.6,24.13 100.46,25.27 JP9.13 96.52,25.4 96.14,25.02 82.04,25.02 81.28,25.78 LCD_0.8
D47  (via drill 0.6)
  Top 0.305: JP8.4 102.87,25.4 101.6,24.13 v97.79,24.13
  Bottom 0.305: JP8.4 105.41,25.4 106.68,26.67 109.35,26.67 JP16.4 | LCD_0.10 78.74,25.4 80.01,24.13 v97.79,24.13
D48
  Bottom 0.305: JP17.14 106.68,22.86 105.41,21.59 101.6,21.59 100.33,22.86 JP9.14 82.93,22.86 LCD_1.7
D49
  Top 0.305: JP8.3 102.74,22.73 101.6,21.59 96.52,21.59 95.63,20.7 95.63,19.18 95.12,18.67 LCD_1.2
  Bottom 0.305: JP8.3 105.41,22.86 106.68,24.13 109.09,24.13 JP16.3
D50
  Top 0.305: JP9.15 100.33,20.45 97.41,20.45 96.52,19.56 96.52,18.54 95.63,17.65 87.25,17.65 86.36,18.54 LCD_1.4
  Bottom 0.305: JP9.15 100.46,20.19 101.6,19.05 105.41,19.05 106.68,20.32 JP17.15
D51  (via drill 0.6)
  Top 0.305: JP8.2 102.87,20.32 101.6,19.05 v97.79,19.05
  Bottom 0.305: JP8.2 105.41,20.32 106.68,21.59 109.35,21.59 JP16.2 | LCD_1.6 83.82,19.3 84.33,19.81 97.03,19.81 v97.79,19.05
D52
  Bottom 0.305: JP17.16 106.68,17.78 105.41,16.51 101.6,16.51 100.33,17.78 JP9.16 96.65,17.78 96.14,17.27 81.79,17.27 81.28,17.78 LCD_1.8
D53  (via drill 0.6)
  Top 0.305: JP8.1 102.74,17.65 101.6,16.51 v97.79,16.51
  Bottom 0.305: JP8.1 105.41,17.78 106.68,19.05 109.09,19.05 JP16.1 | LCD_1.10 78.74,17.78 80.01,16.51 v97.79,16.51
E_DSEN_LED
  Bottom 0.508: ABOX_HARN_3.CKT2 13.97,76.2 16.76,78.99 61.98,78.99 65.79,75.18 DSW_SM.CKT2
E_DSEN_SW
  Top 0.508: STEER.CKT2 11.94,33.53 11.94,66.55 13.97,68.58 18.29,68.58 18.29,70.61 19.3,71.63 ABOX_HARN_3.CKT3
GFD_LED
  Bottom 0.508: ABOX_HARN_3.CKT1 17.53,75.44 17.53,77.98 58.67,77.98 DSW_SM.CKT1
GND  (via drill 0.6)
  Bottom 1.27: JP27.1 JP26.1 JP25.1 JP24.1 JP23.1 JP22.1 JP21.1 JP20.1
  other vias: 68.83,49.91
  pour Bottom (isolate 0.305): 0,0 113.03,0 113.03,88.9 0,88.9
  pour Top (isolate 0.305): 0,0 113.03,0 113.03,88.9 0,88.9
LAUNCH_LED  (via drill 0.3)
  Top 0.508: v28.45,25.4 21.34,32.51 21.34,55.12 19.05,57.4 19.05,61.21 19.3,61.47 ABOX_HARN_2.CKT3
  Bottom 0.508: CD4504BE1.3 46.99,25.4 v28.45,25.4
LAUNCH_SW  (via drill 0.3)
  Top 0.508: CD4504BE.2 29.97,48.77 v29.97,53.59
  Bottom 0.508: v29.97,53.59 29.21,54.36 19.56,54.36 ABOX_HARN_1.CKT4
LAUNCHSW_12
  Top 0.508: DSW_LG_0.CKT2 28.19,72.9 28.19,36.58 R13.P$2
  Bottom 0.508: CD4504BE.3 38.86,38.86 32.51,38.86 R13.P$2
LAUNCHSW_LED  (via drill 0.3)
  Top 0.508: v31.24,31.5 26.16,36.58 26.16,69.34 DSW_LG_0.CKT3
  Bottom 0.508: CD4504BE1.2 43.43,31.5 v31.24,31.5
LCD_BR
  Bottom 0.305: R11.S 74.93,20.32 | 74.93,20.32 76.2,21.59 76.2,27.3 77.47,28.57 82.55,28.57 LCD_0.5 | LCD_1.5 83.57,21.21 82.3,19.94 75.31,19.94 74.93,20.32
MODE0
  Bottom 0.508: ABOX_HARN_1.CKT2 13.97,54.61 13.97,59.69 14.73,59.69 19.05,64.01 28.96,64.01 31.75,66.8 37.85,66.8 40.39,69.34 DSW_LG_1.CKT4
MODE1
  Top 0.508: 17.53,66.55 17.53,52.07 19.3,50.29 ABOX_HARN_1.CKT3 | 46.23,76.2 46.23,75.18 DSW_LG_2.CKT1
  Top 0.61: 17.53,66.55 17.53,66.82 arc-45 17.6,67 18.41,67.82 22.37,67.82 arc45 22.55,67.89 23.37,68.71 23.37,71.52 arc-45 23.44,71.7 24.13,72.39 26.06,72.39 arc45 26.24,72.46 28.19,74.42 28.19,76.35 arc-45 28.27,76.53 29.72,77.98 44.34,77.98 arc-45 44.52,77.9 46.23,76.2
N$4
  Bottom 0.406: Q1.2 82.55,36.83 83.82,35.56 R5.P$1
N$5
  Top 0.356: 88.65,45.72 90.17,44.2
  Top 0.406: 90.17,44.2 90.17,39.37 91.44,38.1 R7.P$2 R5.P$2 | 88.65,45.72 Q5.1 87.5,45.72
N$6  (via drill 0.6)
  Top 0.406: Q5.2 87,43.81 85.6,42.42 v80.14,42.42 | v77.85,40.51 73.79,40.51 R6.P$1
  Bottom 0.406: v77.85,40.51 v80.14,42.42
N$7
  Top 0.406: R7.P$1 LED3.A
N$8
  Bottom 0.406: R10.P$2 72.39,38.1 71.12,39.37 71.12,40.64 73.66,43.18 76.2,43.18 Q2.2
N$10
  Bottom 0.406: R10.P$1 67.31,38.1 | 67.31,38.1 68.58,39.37 Q4.1 | R8.P$1 72.39,35.56 71.12,36.83 68.58,36.83 67.31,38.1
N$126
  Bottom 0.305: R1.P$1 27.3,14.61 30.61,14.61 31.24,15.24 31.24,16.64 31.88,17.27 32.77,17.27 LED1.A
N$127
  Bottom 0.305: R2.P$1 LED2.A
RES
  Bottom 0.305: JP10.1 JP18.1 36.8,5.08 S1.4 S1.3 27.84,5.36 R3.P$1
RX0
  Top 0.203: JP4.1 69.85,58.42
  Bottom 0.406: JP2.1 JP4.1
SCL
  Top 0.203: JP5.1 74.93,58.42
  Bottom 0.406: JP13.1 JP5.1
SDA
  Bottom 0.406: JP13.2 JP5.2
SERIAL_K
  Top 0.356: 77.6,44.07 76.2,45.47
  Top 0.406: R6.P$2 68.58,40.64 69.85,41.91 71.12,41.91 Q2.1 75.82,45.72 76.2,45.47 | R9.P$1 80.01,40.64 77.6,43.05 77.6,44.07
  Bottom 0.508: R6.P$2 64.26,38.86 48.51,38.86 48.51,34.8 47.5,33.78 27.69,33.78 27.69,36.07 31.24,39.62 32.77,39.62 32.77,41.15 32.26,41.66 28.7,41.66 25.15,38.1 15.75,38.1 13.97,39.88 ABOX_HARN_0.CKT1
SHFT_D  (via drill 0.3)
  Top 0.508: R16.P$2 30.48,21.59 21.08,21.59 20.7,21.97 | CD4504BE.9 52.07,46.99 52.07,37.85 50.8,36.58 v50.8,34.54 | 19.56,31.24 19.56,31.5 STEER.CKT4
  Top 1.27: ABOX_PWR.CKT4 20.14,21.41 20.7,21.97 21.59,22.86 21.59,29.21 20.32,30.48 20.32,30.66 STEER.CKT4
  Bottom 0.508: v50.8,34.54 48.77,32.51 20.32,32.51 19.56,31.75 STEER.CKT4
SHFT_U
  Top 0.508: CD4504BE.7 47.5,37.34 40.89,37.34 40.89,34.54 R15.P$1
  Bottom 0.508: R15.P$1 32.77,26.42 20.32,26.42 19.56,27.18 STEER.CKT3
  Bottom 1.27: ABOX_PWR.CKT3 19.41,17.42 16.51,20.32 16.51,25.4 17.78,26.67 18.72,26.67 STEER.CKT3
SW1  (via drill 0.3)
  Top 0.508: v13.21,33.53 13.21,33.78 19.3,39.88 ABOX_HARN_0.CKT3
  Bottom 0.508: v13.21,33.53 12.19,34.54 11.43,34.54 11.18,34.8 11.18,69.85 14.73,69.85 19.05,74.17 22.61,74.17 25.4,76.96 48.77,76.96 50.55,75.18 DSW_LG_2.CKT2
SW2  (via drill 0.3)
  Top 0.508: v47.5,54.1 49.78,56.39 49.78,66.04 46.48,69.34 DSW_LG_2.CKT3
  Bottom 0.508: v47.5,54.1 39.12,54.1 33.27,48.26 21.59,48.26 19.63,46.3 arc45 19.56,46.12 19.56,44.45 ABOX_HARN_0.CKT4
SW3  (via drill 0.3)
  Top 0.508: v49.78,55.12 50.55,55.88 50.55,69.34 DSW_LG_2.CKT4
  Bottom 0.508: ABOX_HARN_1.CKT1 16.26,52.58 36.32,52.58 38.86,55.12 v49.78,55.12
TRA_CTL_LED
  Top 0.508: CD4504BE1.4 54.86,30.73 58.42,30.73 58.42,41.15 71.37,54.1 71.37,66.55 66.55,71.37 36.32,71.37 36.32,74.93 DSW_LG_1.CKT1
TRA_CTL_POT
  Bottom 0.508: ABOX_HARN_2.CKT2 13.97,66.04 15.75,67.82 25.15,67.82 25.4,67.56 34.29,67.56 36.07,69.34 DSW_LG_1.CKT3
TRA_CTL_SW  (via drill 0.3)
  Top 0.508: v18.54,42.42 15.75,45.21 15.75,59.69 13.97,61.47 ABOX_HARN_2.CKT1
  Bottom 0.508: CD4504BE.4 41.4,42.42 v18.54,42.42
TRA_CTL_SW_12  (via drill 0.3)
  Top 0.508: 44.58,39.5 43.94,38.86 39.37,38.86 R14.P$2 | 44.58,39.5 CD4504BE.5 | v48.77,56.64 44.45,52.32 44.45,39.62 44.58,39.5
  Bottom 0.508: v48.77,56.64 49.78,56.64 49.78,64.52 49.53,64.77 48.51,64.77 41.91,71.37 32.26,71.37 30.48,69.6 DSW_LG_0.CKT4
TRAC_LED  (via drill 0.3)
  Top 0.508: v30.73,24.38 24.13,30.99 24.13,61.21 19.56,65.79 ABOX_HARN_2.CKT4
  Bottom 0.508: CD4504BE1.5 51.05,24.38 v30.73,24.38
TX1
  Top 0.203: JP4.2 67.31,58.42
  Bottom 0.406: JP2.2 JP4.2
VIN  (via drill 0.3, 0.6)
  Top 0.508: v38.35,37.85 CD4504BE.1
  Top 0.813: JP10.6 52.07,10.16 64.77,22.86 64.77,30.48 | 64.77,30.48 67.31,33.02 84.71,33.02 85.98,33.91 90.17,33.91 91.44,33.02 93.98,33.02 95.25,34.29 95.25,38.1 R9.P$2 | 64.77,30.48 62.23,30.48 v60.96,31.75 | CD4504BE1.16 44.45,34.29 46.99,31.75 v54.61,31.75
  Top 1.27: DSW_LG_0.CKT1 24.16,75.01 arc-45 23.98,75.08 19.05,80.01 14.07,80.01 arc45 13.9,79.94 9.02,75.06 v9.02,22.1
  Top 1.778: ABOX_PWR.CKT1 13.89,17.6 arc-45 13.97,17.78 16.51,20.32 16.51,25.4 15.24,26.67 14.69,26.67 arc-45 14.51,26.74 STEER.CKT1
  Bottom 0.508: v38.35,37.85 39.12,37.08 42.93,37.08 CD4504BE1.16
  Bottom 0.61: R9.P$2 91.44,41.91 91.44,44.45 Q5.3
  Bottom 0.813: v54.61,31.75 v60.96,31.75
  Bottom 1.27: v9.02,22.1 arc45 9.04,22.05 ABOX_PWR.CKT1
  Bottom 1.778: JP10.6 JP18.6 52.07,3.81 50.8,2.54 21.59,2.54 17.78,6.35 17.78,13.97 14.55,17.2 ABOX_PWR.CKT1

### Text on the board
tPlace: DSW_LG | DSW_SM | GND | 5V | AUTOBOX HARNESS | 5V | 9 | 8 | 7 | 6 | 5 | 4 | 3 | 2 | 1 | 0 | 22 | 13 | 12 | 11 | 10 | 14 | 15 | 16 | 17 | 18 | 19 | 20 | 21 | GND | 24 | AREF | PWM | TX | RX | TX3 | RX3 | TX2 | RX2 | TX1 | RX1 | SDA | SCL | 26 | COMMUNICATION | 28 | 30 | 31 | STAT | 32 | 33 | 34 | 35 | 36 | 37 | K - TX/RX | 38 | 39 | STEER | 40 | 41 | DIGITAL | 42 | 43 | 44 | 45 | LCD_BRIGHT | 46 | 47 | 48 | 49 | 50 | 51 | MHybrid / Dashboard Rev0.1 / Brian Margosian '15 | 52 | 53 | POWER | ANALOG IN | GND | AUTOBOX / POWER | RES | 3V3 | 5V | GND | VIN | 0 | 1 | 2 | 3 | 4 | 5 | 6 | 7 | 8 | 9 | 10 | 11 | 12 | 13 | 14 | 15 | RESET
_tNames: JP20 | JP21 | JP22 | JP23 | ABOX_HARN_3 | JP24 | JP25 | JP26 | JP27 | ABOX_HARN_2 | DSW_LG_0 | DSW_LG_1 | DSW_LG_2 | DSW_SM | JP13 | JP1 | JP2 | JP5 | JP12 | ABOX_HARN_1 | JP9 | JP17 | JP3 | JP4 | LED2 | R4 | ABOX_HARN_0 | R2 | Q4 | Q2 | Q1 | Q5 | R9 | CD4504BE | R10 | R6 | R7 | LED3 | R5 | LCD_0 | STEER | R16 | R8 | R13 | R12 | R15 | R14 | CD4504BE1 | LCD_1 | ABOX_PWR | R11 | JP11 | JP8 | JP16 | R1 | JP10 | JP7 | JP6 | S1 | R3 | JP18 | JP15 | JP14 | JP20 | JP21 | JP22 | JP23 | ABOX_HARN_3 | JP24 | JP25 | JP26 | JP27 | ABOX_HARN_2 | DSW_LG_0 | DSW_LG_1 | DSW_LG_2 | DSW_SM | JP13 | JP1 | JP2 | JP5 | JP12 | ABOX_HARN_1 | JP3 | JP4 | JP9 | JP17 | LED2 | R4 | ABOX_HARN_0 | R2 | Q4 | Q2 | Q1 | Q5 | R9 | CD4504BE | R10 | R6 | R7 | LED3 | R5 | LCD_0 | STEER | R16 | R8 | R13 | R12 | R15 | R14 | CD4504BE1 | LCD_1 | ABOX_PWR | R11 | JP11 | JP8 | JP16 | R1 | JP10 | JP7 | JP6 | S1 | R3 | JP18 | JP15 | JP14